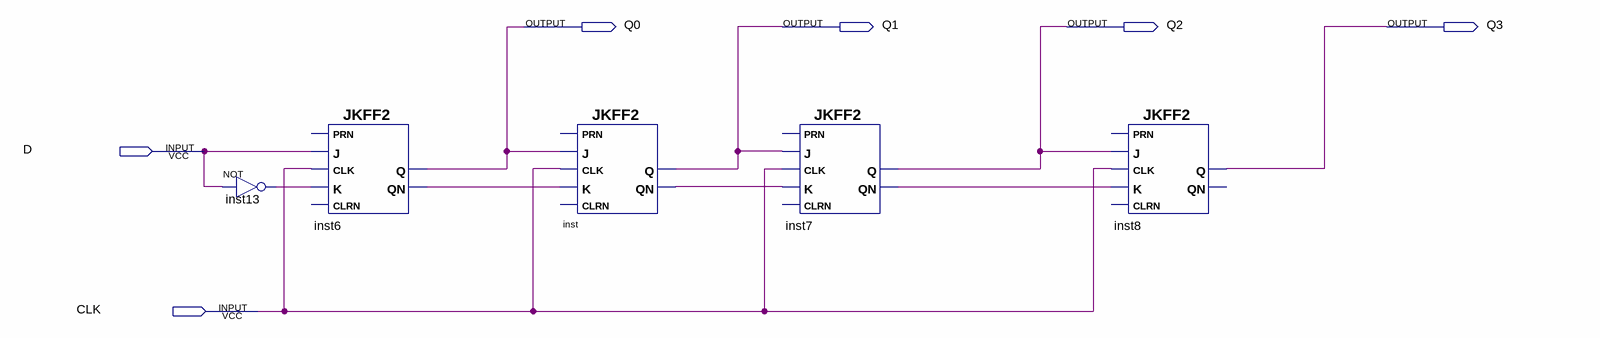
[diagram p0: schematic sheet]
// Quartus schematic ex1.bdf as structural Verilog: 5 symbols, 6 pins
module ex1 (
  input  D,
  input  CLK,
  output Q0,
  output Q1,
  output Q2,
  output Q3
);

  wire inst6_qn, inst7_qn, inst13_out, inst_qn;

  not inst13 (inst13_out, D);
  JKFF2 inst6 (.K(inst13_out), .CLK(CLK), .J(D), .QN(inst6_qn), .Q(Q0));  // open: CLRN, PRN
  JKFF2 inst (.K(inst6_qn), .CLK(CLK), .J(Q0), .QN(inst_qn), .Q(Q1));  // open: CLRN, PRN
  JKFF2 inst7 (.K(inst_qn), .CLK(CLK), .J(Q1), .QN(inst7_qn), .Q(Q2));  // open: CLRN, PRN
  JKFF2 inst8 (.K(inst7_qn), .CLK(CLK), .J(Q2), .Q(Q3));  // open: CLRN, PRN, QN
endmodule
